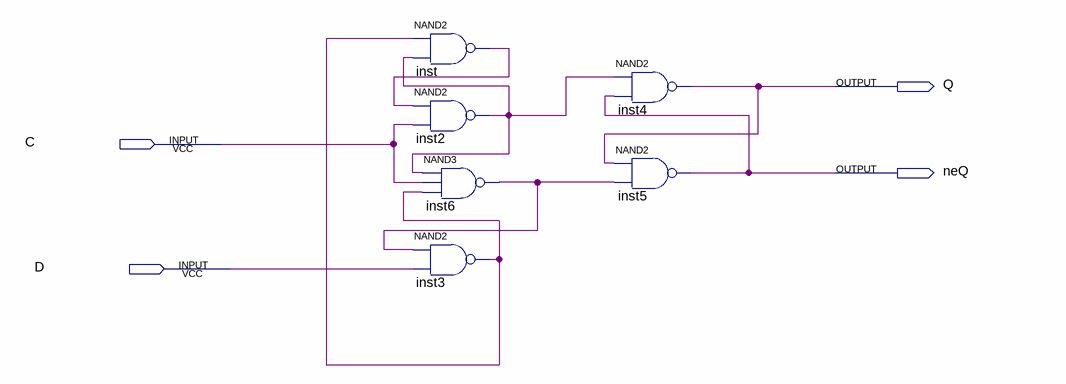
[diagram p0: schematic sheet]
// Quartus schematic Dynamic_D_trigger.bdf as structural Verilog: 6 symbols, 4 pins
module Dynamic_D_trigger (
  input  C,
  input  D,
  output Q,
  output neQ
);

  wire inst2_out, inst3_out, inst6_out, inst_out;

  nand inst (inst_out, inst3_out, inst2_out);
  nand inst2 (inst2_out, inst_out, C);
  nand inst6 (inst6_out, inst2_out, C, inst3_out);
  nand inst3 (inst3_out, inst6_out, D);
  nand inst4 (Q, inst2_out, neQ);
  nand inst5 (neQ, Q, inst6_out);
endmodule
